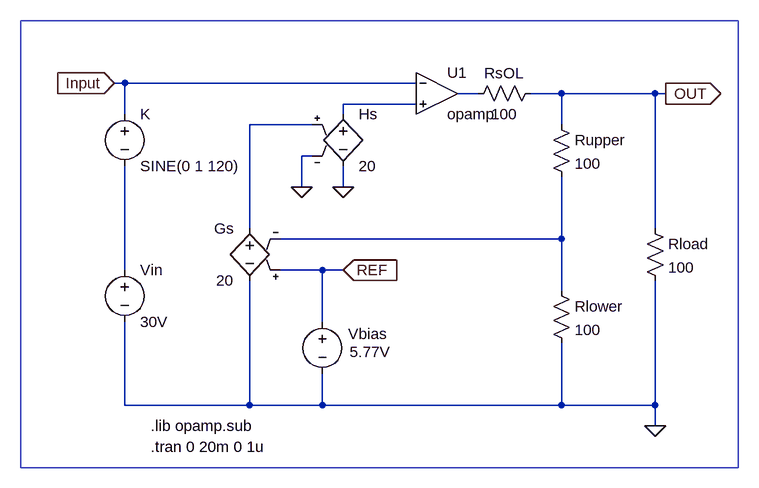
[diagram p0: schematic Switch-Mode_Power_Supplies_-_Basso-_Figure_1-6.asc]
Switch-Mode_Power_Supplies_-_Basso-_Figure_1-6.asc, the LTspice schematic file:
Version 4
SHEET 1 880 852
WIRE -1072 -64 -1088 -64
WIRE -624 -64 -1072 -64
WIRE -528 -48 -560 -48
WIRE -400 -48 -448 -48
WIRE -256 -48 -400 -48
WIRE -240 -48 -256 -48
WIRE -624 -32 -736 -32
WIRE -1072 -16 -1072 -64
WIRE -736 -16 -736 -32
WIRE -784 0 -880 0
WIRE -400 0 -400 -48
WIRE -784 48 -800 48
WIRE -800 96 -800 48
WIRE -736 96 -736 64
WIRE -880 160 -880 0
WIRE -256 160 -256 -48
WIRE -400 176 -400 80
WIRE -400 176 -832 176
WIRE -1072 224 -1072 64
WIRE -768 224 -832 224
WIRE -736 224 -768 224
WIRE -400 256 -400 176
WIRE -768 304 -768 224
WIRE -1072 432 -1072 304
WIRE -880 432 -880 240
WIRE -880 432 -1072 432
WIRE -768 432 -768 384
WIRE -768 432 -880 432
WIRE -400 432 -400 336
WIRE -400 432 -768 432
WIRE -256 432 -256 240
WIRE -256 432 -400 432
WIRE -256 464 -256 432
FLAG -256 464 0
FLAG -240 -48 OUT
IOPIN -240 -48 Out
FLAG -800 96 0
FLAG -736 96 0
FLAG -736 224 REF
IOPIN -736 224 In
FLAG -1088 -64 Input
IOPIN -1088 -64 In
SYMBOL voltage -768 288 R0
WINDOW 123 0 0 Left 0
WINDOW 39 0 0 Left 0
WINDOW 0 40 34 Left 0
WINDOW 3 42 62 Left 0
SYMATTR InstName Vbias
SYMATTR Value 5.77V
SYMBOL res -272 144 R0
SYMATTR InstName Rload
SYMATTR Value 100
SYMBOL res -416 -16 R0
SYMATTR InstName Rupper
SYMATTR Value 100
SYMBOL res -416 240 R0
SYMATTR InstName Rlower
SYMATTR Value 100
SYMBOL e2 -880 144 M0
SYMATTR InstName Gs
SYMATTR Value 20
SYMBOL e -736 -32 R0
SYMATTR InstName Hs
SYMATTR Value 20
SYMBOL res -432 -64 R90
WINDOW 0 0 56 VBottom 0
WINDOW 3 32 56 VTop 0
SYMATTR InstName RsOL
SYMATTR Value 100
SYMBOL voltage -1072 -32 R0
WINDOW 123 0 0 Left 0
WINDOW 39 0 0 Left 0
SYMATTR InstName K
SYMATTR Value SINE(0 1 120)
SYMBOL voltage -1072 208 R0
SYMATTR InstName Vin
SYMATTR Value 30V
SYMBOL Opamps\\opamp -592 -112 R0
SYMATTR InstName U1
SYMATTR SpiceLine Aol=10
TEXT -1032 496 Left 0 !.tran 0 20m 0 1u
TEXT -1032 464 Left 0 !.lib opamp.sub
RECTANGLE Normal -128 528 -1232 -160

The netlist it stands for:
* Switch-Mode_Power_Supplies_-_Basso-_Figure_1-6.asc
Vbias REF 0 5.77V
Rload OUT 0 100
Rupper OUT N004 100
Rlower N004 0 100
E§Gs N003 0 REF N004 20
E§Hs N002 0 N003 0 20
RsOL OUT N001 100
V§K Input N005 SINE(0 1 120)
Vin N005 0 30V
XU1 Input N002 N001 opamp Aol=10 GBW=10Meg  ; pins invin noninvin out
.tran 0 20m 0 1u
.lib opamp.sub
.backanno
.end